# Altium schematic sheet Arduino FPGA Top-Level Interface.SchDoc
size A4
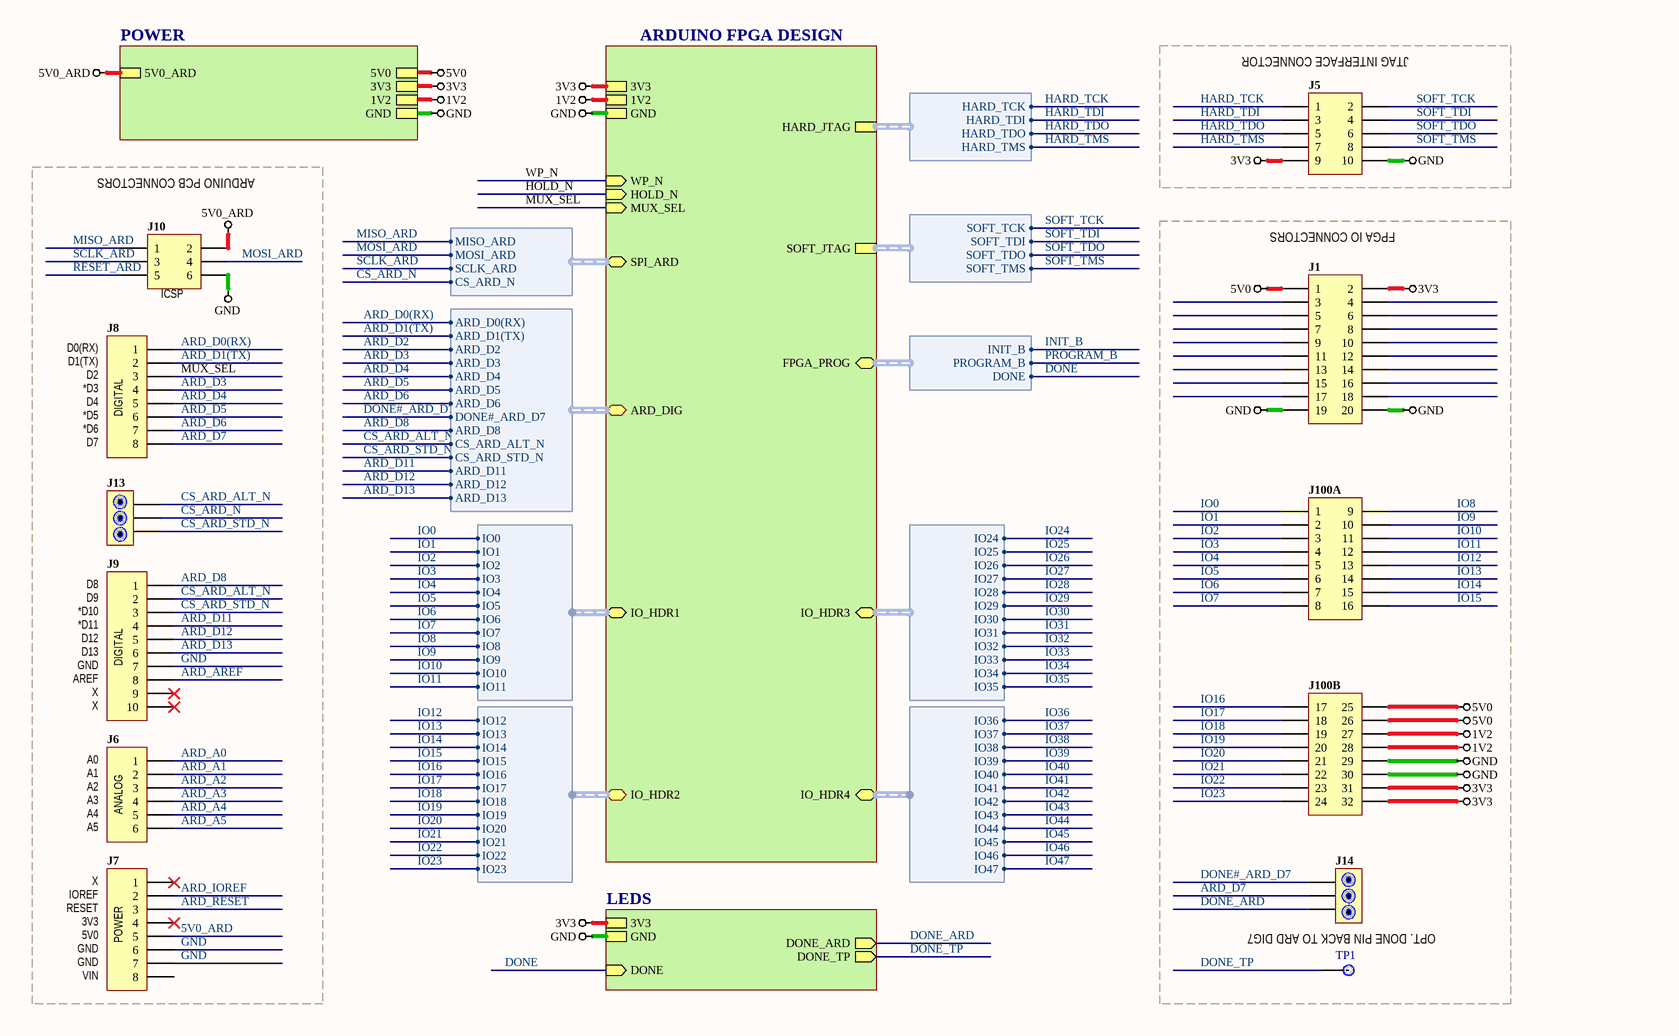
[diagram p0: Arduino FPGA Top-Level Interface.SchDoc]

## Parts
J1  Header 10X2  [HEADER_10X2]  (value not drawn)
J5  Header 5X2  [HDR2X5]  (value not drawn)
J6  Header 6  [1X06]  (value not drawn)
J7  Header 8  [1X08]  (value not drawn)
J8  Header 8  [1X08]  (value not drawn)
J9  Header 10  [1X10@1]  (value not drawn)
J10  Header 3X2  [2X03]  (value not drawn)
J13  3-WAY JUMPER  [HDR1X3]  (value not drawn)
J14  3-WAY JUMPER  [HDR1X3]  (value not drawn)
J100  ARR_32P  [ARR_100X100X32P]  (value not drawn)  (parts A,B of 2)
TP1  TESTPOINT_TH  [TESTPOINT_TH]  (value not drawn)

## Blocks framed on the sheet
JTAG INTERFACE CONNECTOR: J5
ARDUINO PCB CONNECTORS: J6-J10 J13

## Sub-sheets
ARDUINO FPGA DESIGN = Arduino FPGA Design.SchDoc: 3V3, GND, 1V2, HARD_JTAG (harness HARD_JTAG), SOFT_JTAG (harness SOFT_JTAG), WP_N (in), HOLD_N (in), IO_HDR2 (harness IO_HDR2), IO_HDR3 (harness IO_HDR3), IO_HDR4 (harness IO_HDR4), MUX_SEL (in), IO_HDR1 (harness IO_HDR1), FPGA_PROG (harness FPGA_PROGRAM), ARD_DIG (harness ARDUINO_DIGITAL), SPI_ARD (harness SPI_ARD)
LEDS = LEDS - Status.SchDoc: 3V3, GND, DONE (in), DONE_ARD (out), DONE_TP (out)
POWER = Power - 5V0.SchDoc: 5V0, 3V3, 1V2, GND, 5V0_ARD

## Harnesses
HARD_JTAG: HARD_TCK, HARD_TDI, HARD_TDO, HARD_TMS
SOFT_JTAG: SOFT_TCK, SOFT_TDI, SOFT_TDO, SOFT_TMS
FPGA_PROGRAM: INIT_B, PROGRAM_B, DONE
SPI_ARD: MISO_ARD, MOSI_ARD, SCLK_ARD, CS_ARD_N
IO_HDR1: IO0, IO1, IO2, IO3, IO4, IO5, IO6, IO7, IO8, IO9, IO10, IO11
IO_HDR3: IO24, IO25, IO26, IO27, IO28, IO29, IO30, IO31, IO32, IO33, IO34, IO35
IO_HDR4: IO36, IO37, IO38, IO39, IO40, IO41, IO42, IO43, IO44, IO45, IO46, IO47
IO_HDR2: IO12, IO13, IO16, IO17, IO18, IO19, IO20, IO21, IO22, IO23, IO14, IO15
ARDUINO_DIGITAL: ARD_D0(RX), ARD_D1(TX), ARD_D2, ARD_D3, ARD_D4, ARD_D5, ARD_D6, DONE#_ARD_D7, ARD_D8, CS_ARD_ALT_N, CS_ARD_STD_N, ARD_D11, ARD_D12, ARD_D13

## Nets
1V2: J100.27 J100.28 ; sheet ARDUINO FPGA DESIGN/1V2, sheet POWER/1V2
3V3: J1.2 J5.9 J100.31 J100.32 ; sheet ARDUINO FPGA DESIGN/3V3, sheet POWER/3V3, sheet LEDS/3V3
5V0: J1.1 J100.25 J100.26 ; sheet POWER/5V0
5V0_ARD: J7.5 ; sheet POWER/5V0_ARD
GND: J1.19 J1.20 J5.10 J7.6 J7.7 J9.7 J10.6 J100.29 J100.30 ; sheet ARDUINO FPGA DESIGN/GND, sheet POWER/GND, sheet LEDS/GND
ARD_A0: J6.1
ARD_A1: J6.2
ARD_A2: J6.3
ARD_A3: J6.4
ARD_A4: J6.5
ARD_A5: J6.6
ARD_AREF: J9.8
ARD_D0(RX): J8.1 ; sheet ARDUINO FPGA DESIGN/ARD_DIG.ARD_D0(RX)
ARD_D1(TX): J8.2 ; sheet ARDUINO FPGA DESIGN/ARD_DIG.ARD_D1(TX)
ARD_D2: sheet ARDUINO FPGA DESIGN/ARD_DIG.ARD_D2
ARD_D3: J8.4 ; sheet ARDUINO FPGA DESIGN/ARD_DIG.ARD_D3
ARD_D4: J8.5 ; sheet ARDUINO FPGA DESIGN/ARD_DIG.ARD_D4
ARD_D5: J8.6 ; sheet ARDUINO FPGA DESIGN/ARD_DIG.ARD_D5
ARD_D6: J8.7 ; sheet ARDUINO FPGA DESIGN/ARD_DIG.ARD_D6
ARD_D7: J8.8 J14.2
ARD_D8: J9.1 ; sheet ARDUINO FPGA DESIGN/ARD_DIG.ARD_D8
ARD_D11: J9.4 ; sheet ARDUINO FPGA DESIGN/ARD_DIG.ARD_D11
ARD_D12: J9.5 ; sheet ARDUINO FPGA DESIGN/ARD_DIG.ARD_D12
ARD_D13: J9.6 ; sheet ARDUINO FPGA DESIGN/ARD_DIG.ARD_D13
ARD_IOREF: J7.2
ARD_RESET: J7.3
CS_ARD_ALT_N: J9.2 J13.3 ; sheet ARDUINO FPGA DESIGN/ARD_DIG.CS_ARD_ALT_N
CS_ARD_N: J13.2 ; sheet ARDUINO FPGA DESIGN/SPI_ARD.CS_ARD_N
CS_ARD_STD_N: J9.3 J13.1 ; sheet ARDUINO FPGA DESIGN/ARD_DIG.CS_ARD_STD_N
DONE: sheet LEDS/DONE, sheet ARDUINO FPGA DESIGN/FPGA_PROG.DONE
DONE#_ARD_D7: J14.3 ; sheet ARDUINO FPGA DESIGN/ARD_DIG.DONE#_ARD_D7
DONE_ARD: J14.1 ; sheet LEDS/DONE_ARD
DONE_TP: TP1.1 ; sheet LEDS/DONE_TP
HARD_TCK: J5.1 ; sheet ARDUINO FPGA DESIGN/HARD_JTAG.HARD_TCK
HARD_TDI: J5.3 ; sheet ARDUINO FPGA DESIGN/HARD_JTAG.HARD_TDI
HARD_TDO: J5.5 ; sheet ARDUINO FPGA DESIGN/HARD_JTAG.HARD_TDO
HARD_TMS: J5.7 ; sheet ARDUINO FPGA DESIGN/HARD_JTAG.HARD_TMS
HOLD_N: sheet ARDUINO FPGA DESIGN/HOLD_N
INIT_B: sheet ARDUINO FPGA DESIGN/FPGA_PROG.INIT_B
IO0: J100.1 ; sheet ARDUINO FPGA DESIGN/IO_HDR1.IO0
IO1: J100.2 ; sheet ARDUINO FPGA DESIGN/IO_HDR1.IO1
IO2: J100.3 ; sheet ARDUINO FPGA DESIGN/IO_HDR1.IO2
IO3: J100.4 ; sheet ARDUINO FPGA DESIGN/IO_HDR1.IO3
IO4: J100.5 ; sheet ARDUINO FPGA DESIGN/IO_HDR1.IO4
IO5: J100.6 ; sheet ARDUINO FPGA DESIGN/IO_HDR1.IO5
IO6: J100.7 ; sheet ARDUINO FPGA DESIGN/IO_HDR1.IO6
IO7: J100.8 ; sheet ARDUINO FPGA DESIGN/IO_HDR1.IO7
IO8: J100.9 ; sheet ARDUINO FPGA DESIGN/IO_HDR1.IO8
IO9: J100.10 ; sheet ARDUINO FPGA DESIGN/IO_HDR1.IO9
IO10: J100.11 ; sheet ARDUINO FPGA DESIGN/IO_HDR1.IO10
IO11: J100.12 ; sheet ARDUINO FPGA DESIGN/IO_HDR1.IO11
IO12: J100.13 ; sheet ARDUINO FPGA DESIGN/IO_HDR2.IO12
IO13: J100.14 ; sheet ARDUINO FPGA DESIGN/IO_HDR2.IO13
IO14: J100.15 ; sheet ARDUINO FPGA DESIGN/IO_HDR2.IO14
IO15: J100.16 ; sheet ARDUINO FPGA DESIGN/IO_HDR2.IO15
IO16: J100.17 ; sheet ARDUINO FPGA DESIGN/IO_HDR2.IO16
IO17: J100.18 ; sheet ARDUINO FPGA DESIGN/IO_HDR2.IO17
IO18: J100.19 ; sheet ARDUINO FPGA DESIGN/IO_HDR2.IO18
IO19: J100.20 ; sheet ARDUINO FPGA DESIGN/IO_HDR2.IO19
IO20: J100.21 ; sheet ARDUINO FPGA DESIGN/IO_HDR2.IO20
IO21: J100.22 ; sheet ARDUINO FPGA DESIGN/IO_HDR2.IO21
IO22: J100.23 ; sheet ARDUINO FPGA DESIGN/IO_HDR2.IO22
IO23: J100.24 ; sheet ARDUINO FPGA DESIGN/IO_HDR2.IO23
IO24: sheet ARDUINO FPGA DESIGN/IO_HDR3.IO24
IO25: sheet ARDUINO FPGA DESIGN/IO_HDR3.IO25
IO26: sheet ARDUINO FPGA DESIGN/IO_HDR3.IO26
IO27: sheet ARDUINO FPGA DESIGN/IO_HDR3.IO27
IO28: sheet ARDUINO FPGA DESIGN/IO_HDR3.IO28
IO29: sheet ARDUINO FPGA DESIGN/IO_HDR3.IO29
IO30: sheet ARDUINO FPGA DESIGN/IO_HDR3.IO30
IO31: sheet ARDUINO FPGA DESIGN/IO_HDR3.IO31
IO32: sheet ARDUINO FPGA DESIGN/IO_HDR3.IO32
IO33: sheet ARDUINO FPGA DESIGN/IO_HDR3.IO33
IO34: sheet ARDUINO FPGA DESIGN/IO_HDR3.IO34
IO35: sheet ARDUINO FPGA DESIGN/IO_HDR3.IO35
IO36: sheet ARDUINO FPGA DESIGN/IO_HDR4.IO36
IO37: sheet ARDUINO FPGA DESIGN/IO_HDR4.IO37
IO38: sheet ARDUINO FPGA DESIGN/IO_HDR4.IO38
IO39: sheet ARDUINO FPGA DESIGN/IO_HDR4.IO39
IO40: sheet ARDUINO FPGA DESIGN/IO_HDR4.IO40
IO41: sheet ARDUINO FPGA DESIGN/IO_HDR4.IO41
IO42: sheet ARDUINO FPGA DESIGN/IO_HDR4.IO42
IO43: sheet ARDUINO FPGA DESIGN/IO_HDR4.IO43
IO44: sheet ARDUINO FPGA DESIGN/IO_HDR4.IO44
IO45: sheet ARDUINO FPGA DESIGN/IO_HDR4.IO45
IO46: sheet ARDUINO FPGA DESIGN/IO_HDR4.IO46
IO47: sheet ARDUINO FPGA DESIGN/IO_HDR4.IO47
MISO_ARD: J10.1 ; sheet ARDUINO FPGA DESIGN/SPI_ARD.MISO_ARD
MOSI_ARD: J10.4 ; sheet ARDUINO FPGA DESIGN/SPI_ARD.MOSI_ARD
MUX_SEL: J8.3 ; sheet ARDUINO FPGA DESIGN/MUX_SEL
PROGRAM_B: sheet ARDUINO FPGA DESIGN/FPGA_PROG.PROGRAM_B
RESET_ARD: J10.5
SCLK_ARD: J10.3 ; sheet ARDUINO FPGA DESIGN/SPI_ARD.SCLK_ARD
SOFT_TCK: J5.2 ; sheet ARDUINO FPGA DESIGN/SOFT_JTAG.SOFT_TCK
SOFT_TDI: J5.4 ; sheet ARDUINO FPGA DESIGN/SOFT_JTAG.SOFT_TDI
SOFT_TDO: J5.6 ; sheet ARDUINO FPGA DESIGN/SOFT_JTAG.SOFT_TDO
SOFT_TMS: J5.8 ; sheet ARDUINO FPGA DESIGN/SOFT_JTAG.SOFT_TMS
WP_N: sheet ARDUINO FPGA DESIGN/WP_N

Not connected (* = marked no-connect by the designer): J1 3 4 5 6 7 8 9 10 11 12 13 14 15 16 17 18; J7 1* 4* 8; J9 9* 10*; J10 2

## Notes on the sheet
- FPGA IO CONNECTORS
- (near J10) ICSP
- (near J8) D0(RX)
- (near J8) D1(TX)
- (near J8) D2
- (near J8) *D3
- (near J8) D4
- (near J8) *D5
- (near J8) *D6
- D7
- (near J8) DIGITAL
- D8
- D9
- (near J9) *D10
- (near J9) *D11
- (near J9) D12
- (near J9) D13
- (near J9) GND
- (near J9) AREF
- (near J9) X
- X
- (near J9) DIGITAL
- A0
- (near J6) A1
- (near J6) A2
- (near J6) A3
- (near J6) A4
- A5
- (near J6) ANALOG
- (near J7) IOREF
- (near J7) RESET
- (near J7) 3V3
- OPT. DONE PIN BACK TO ARD DIG7
- (near J7) 5V0
- (near J7) GND
- (near J7) VIN
- (near J7) POWER
- Labels drawn without touching a wire or pin: 5V0_ARD

## Library data of the parts
J1 = Header 10X2: Header, 10-Pin, Dual row; LatestRevisionDate: 17-Jul-2002; LatestRevisionNote: Re-released for DXP Platform.; Publisher: Altium Limited
J5 = Header 5X2: Header, 5-Pin, Dual row; LatestRevisionDate: 17-Jul-2002; LatestRevisionNote: Re-released for DXP Platform.; Publisher: Altium Limited
J6 = Header 6: Header, 6-Pin; LatestRevisionDate: 17-Jul-2002; LatestRevisionNote: Re-released for DXP Platform.; Publisher: Altium Limited
J7 J8 = Header 8: Header, 8-Pin; LatestRevisionDate: 17-Jul-2002; LatestRevisionNote: Re-released for DXP Platform.; Publisher: Altium Limited
J9 = Header 10: Header, 10-Pin; LatestRevisionDate: 17-Jul-2002; LatestRevisionNote: Re-released for DXP Platform.; Publisher: Altium Limited
J10 = Header 3X2: Header, 3-Pin, Dual row; LatestRevisionDate: 17-Jul-2002; LatestRevisionNote: Re-released for DXP Platform.; Publisher: Altium Limited
J13 J14 = 3-WAY JUMPER: 3-Way Jumper - Center Output
J100 = ARR_32P: Pad Array - 32 Pins 100X100mil spacing